# Altium schematic sheet ESP32.SchDoc
size A; SheetNumber: 2; SheetTotal: 6
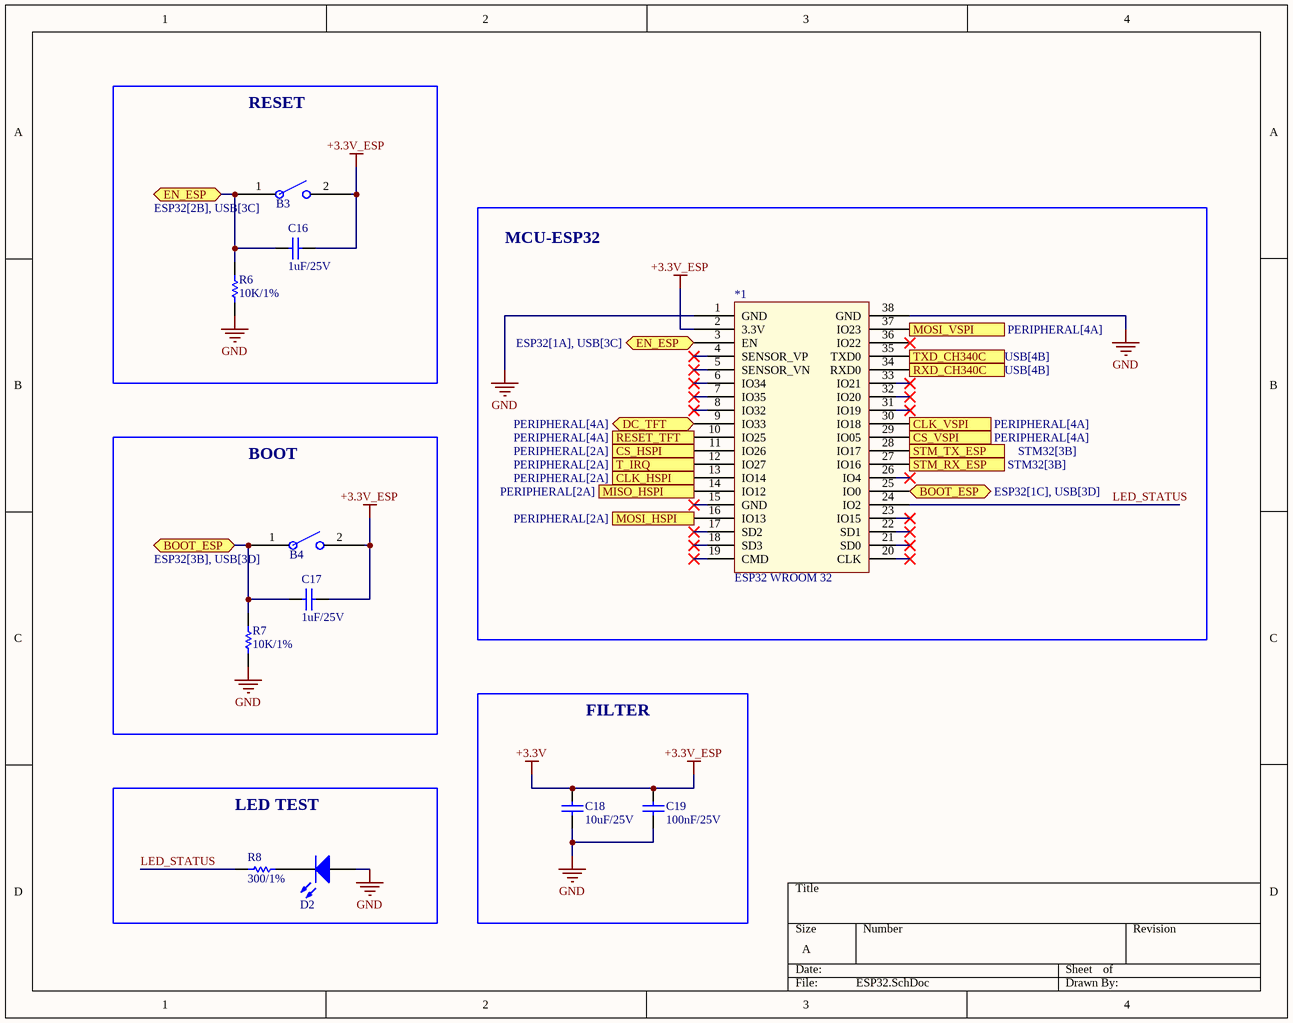
[diagram p0: ESP32.SchDoc]

## Parts
*1  ESP32 WROOM 32  [ESP32-WROOM-32D]
B3  Button SMD 2 Pin 3x4mm  [BUTTON SMD 2 PIN]  (value not drawn)
B4  Button SMD 2 Pin 3x4mm  [BUTTON SMD 2 PIN]  (value not drawn)
C16  value 1uF/25V  [CAP-SM-0805]  (hidden comment: Cap Non-Pol SMD)
C17  value 1uF/25V  [CAP-SM-0805]  (hidden comment: Cap Non-Pol SMD)
C18  value 10uF/25V  [CAP-SM-0805]  (hidden comment: Cap Non-Pol SMD)
C19  value 100nF/25V  [CAP-SM-0805]  (hidden comment: Cap Non-Pol SMD)
D2  LED SMD  [LED_0805_Blue]  (value not drawn)
R6  value 10K/1%  [RES-SM-0805]  (hidden comment: RESISTOR SMD)
R7  value 10K/1%  [RES-SM-0805]  (hidden comment: RESISTOR SMD)
R8  value 300/1%  [RES-SM-0805]  (hidden comment: RESISTOR SMD)

## Blocks framed on the sheet
RESET: B3 C16 R6
MCU-ESP32: *1
BOOT: B4 C17 R7
FILTER: C18 C19
LED TEST: D2 R8

## Ports
BOOT_ESP (bidir, see ESP32[1C], USB[3D]), BOOT_ESP (bidir, see ESP32[3B], USB[3D]), CLK_HSPI (out, see PERIPHERAL[2A]), CLK_VSPI (out, see PERIPHERAL[4A]), CS_HSPI (out, see PERIPHERAL[2A]), CS_VSPI (out, see PERIPHERAL[4A]), DC_TFT (bidir, see PERIPHERAL[4A]), EN_ESP (bidir, see ESP32[1A], USB[3C]), EN_ESP (bidir, see ESP32[2B], USB[3C]), MISO_HSPI (in, see PERIPHERAL[2A]), MOSI_HSPI (out, see PERIPHERAL[2A]), MOSI_VSPI (out, see PERIPHERAL[4A]), RESET_TFT (out, see PERIPHERAL[4A]), RXD_CH340C (out, see USB[4B]), STM_RX_ESP (out, see STM32[3B]), STM_TX_ESP (in, see STM32[3B]), T_IRQ (in, see PERIPHERAL[2A]), TXD_CH340C (in, see USB[4B])

## Nets
+3.3V: *1.2(3.3V) B3.2 B4.2 C16.2 C17.2 C18.2 C19.2  [also labelled +3.3V_ESP]
GND: *1.1(GND) *1.38(GND) C18.1 C19.1 D2.1(A) R6.1 R7.1
BOOT_ESP: *1.25(IO0) B4.1 C17.1 R7.2 ; port BOOT_ESP
CLK_HSPI: *1.13(IO14) ; port CLK_HSPI
CLK_VSPI: *1.30(IO18) ; port CLK_VSPI
CS_HSPI: *1.11(IO26) ; port CS_HSPI
CS_VSPI: *1.29(IO05) ; port CS_VSPI
DC_TFT: *1.9(IO33) ; port DC_TFT
EN_ESP: *1.3(EN) B3.1 C16.1 R6.2 ; port EN_ESP
LED_STATUS: *1.24(IO2) R8.1
MISO_HSPI: *1.14(IO12) ; port MISO_HSPI
MOSI_HSPI: *1.16(IO13) ; port MOSI_HSPI
MOSI_VSPI: *1.37(IO23) ; port MOSI_VSPI
RESET_TFT: *1.10(IO25) ; port RESET_TFT
RXD_CH340C: *1.34(RXD0) ; port RXD_CH340C
STM_RX_ESP: *1.27(IO16) ; port STM_RX_ESP
STM_TX_ESP: *1.28(IO17) ; port STM_TX_ESP
T_IRQ: *1.12(IO27) ; port T_IRQ
TXD_CH340C: *1.35(TXD0) ; port TXD_CH340C
NetD2_2: D2.2(K) R8.2

Not connected (* = marked no-connect by the designer): *1 4(SENSOR_VP)* 5(SENSOR_VN)* 6(IO34)* 7(IO35)* 8(IO32)* 15(GND)* 17(SD2)* 18(SD3)* 19(CMD)* 20(CLK)* 21(SD0)* 22(SD1)* 23(IO15)* 26(IO4)* 31(IO19)* 32(IO20)* 33(IO21)* 36(IO22)*

## Library data of the parts
B3 B4 = BUTTON
C16-C19 = Cap Non-Pol SMD: Capacitor
D2 = LED SMD: LED
R6-R8 = RESISTOR SMD: Resistor